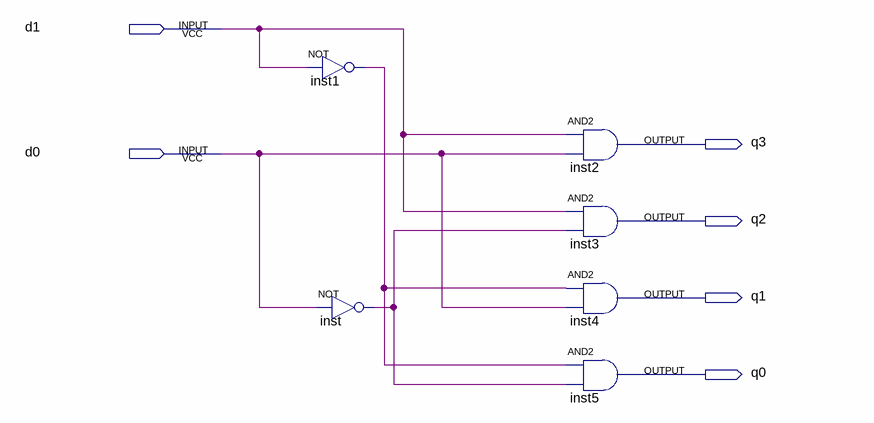
[diagram p0: schematic sheet]
// Quartus schematic 2-4.bdf as structural Verilog: 6 symbols, 6 pins
module \2-4  (
  input  d1,
  input  d0,
  output q3,
  output q2,
  output q1,
  output q0
);

  wire inst1_out, inst_out;

  not inst1 (inst1_out, d1);
  not inst (inst_out, d0);
  and inst2 (q3, d1, d0);
  and inst3 (q2, d1, inst_out);
  and inst4 (q1, inst1_out, d0);
  and inst5 (q0, inst1_out, inst_out);
endmodule
